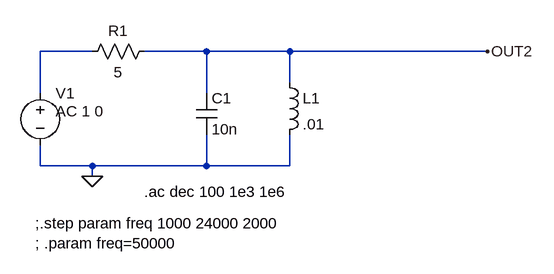
[diagram p0: schematic CircuitBouchon4.asc]
CircuitBouchon4.asc, the LTspice schematic file:
Version 4
SHEET 1 880 680
WIRE 128 80 48 80
WIRE 304 80 208 80
WIRE 432 80 304 80
WIRE 736 80 432 80
WIRE 432 128 432 80
WIRE 48 144 48 80
WIRE 304 144 304 80
WIRE 48 256 48 224
WIRE 128 256 48 256
WIRE 304 256 304 208
WIRE 304 256 128 256
WIRE 432 256 432 208
WIRE 432 256 304 256
WIRE 128 272 128 256
FLAG 128 272 0
FLAG 736 80 OUT2
SYMBOL voltage 48 128 R0
WINDOW 123 24 44 Left 2
WINDOW 39 0 0 Left 0
WINDOW 3 24 44 Left 2
SYMATTR Value2 AC 1 0
SYMATTR Value ""
SYMATTR InstName V1
SYMBOL res 224 64 R90
WINDOW 0 0 56 VBottom 2
WINDOW 3 32 56 VTop 2
SYMATTR InstName R1
SYMATTR Value 5
SYMBOL cap 288 144 R0
SYMATTR InstName C1
SYMATTR Value 10n
SYMBOL ind 416 112 R0
SYMATTR InstName L1
SYMATTR Value .01
TEXT 40 344 Left 2 !;.step param freq 1000 24000 2000\n; .param freq=50000
TEXT 208 296 Left 2 !.ac dec 100 1e3 1e6

The netlist it stands for:
* CircuitBouchon4.asc
V1 N001 0 AC 1 0
R1 OUT2 N001 5
C1 OUT2 0 10n
L1 OUT2 0 .01
;.step param freq 1000 24000 2000
; .param freq=50000
.ac dec 100 1e3 1e6
.backanno
.end